# Altium schematic sheet EXTENTION_DRIVER_PCB.SchDoc
size B; SheetNumber: 1; SheetTotal: 1
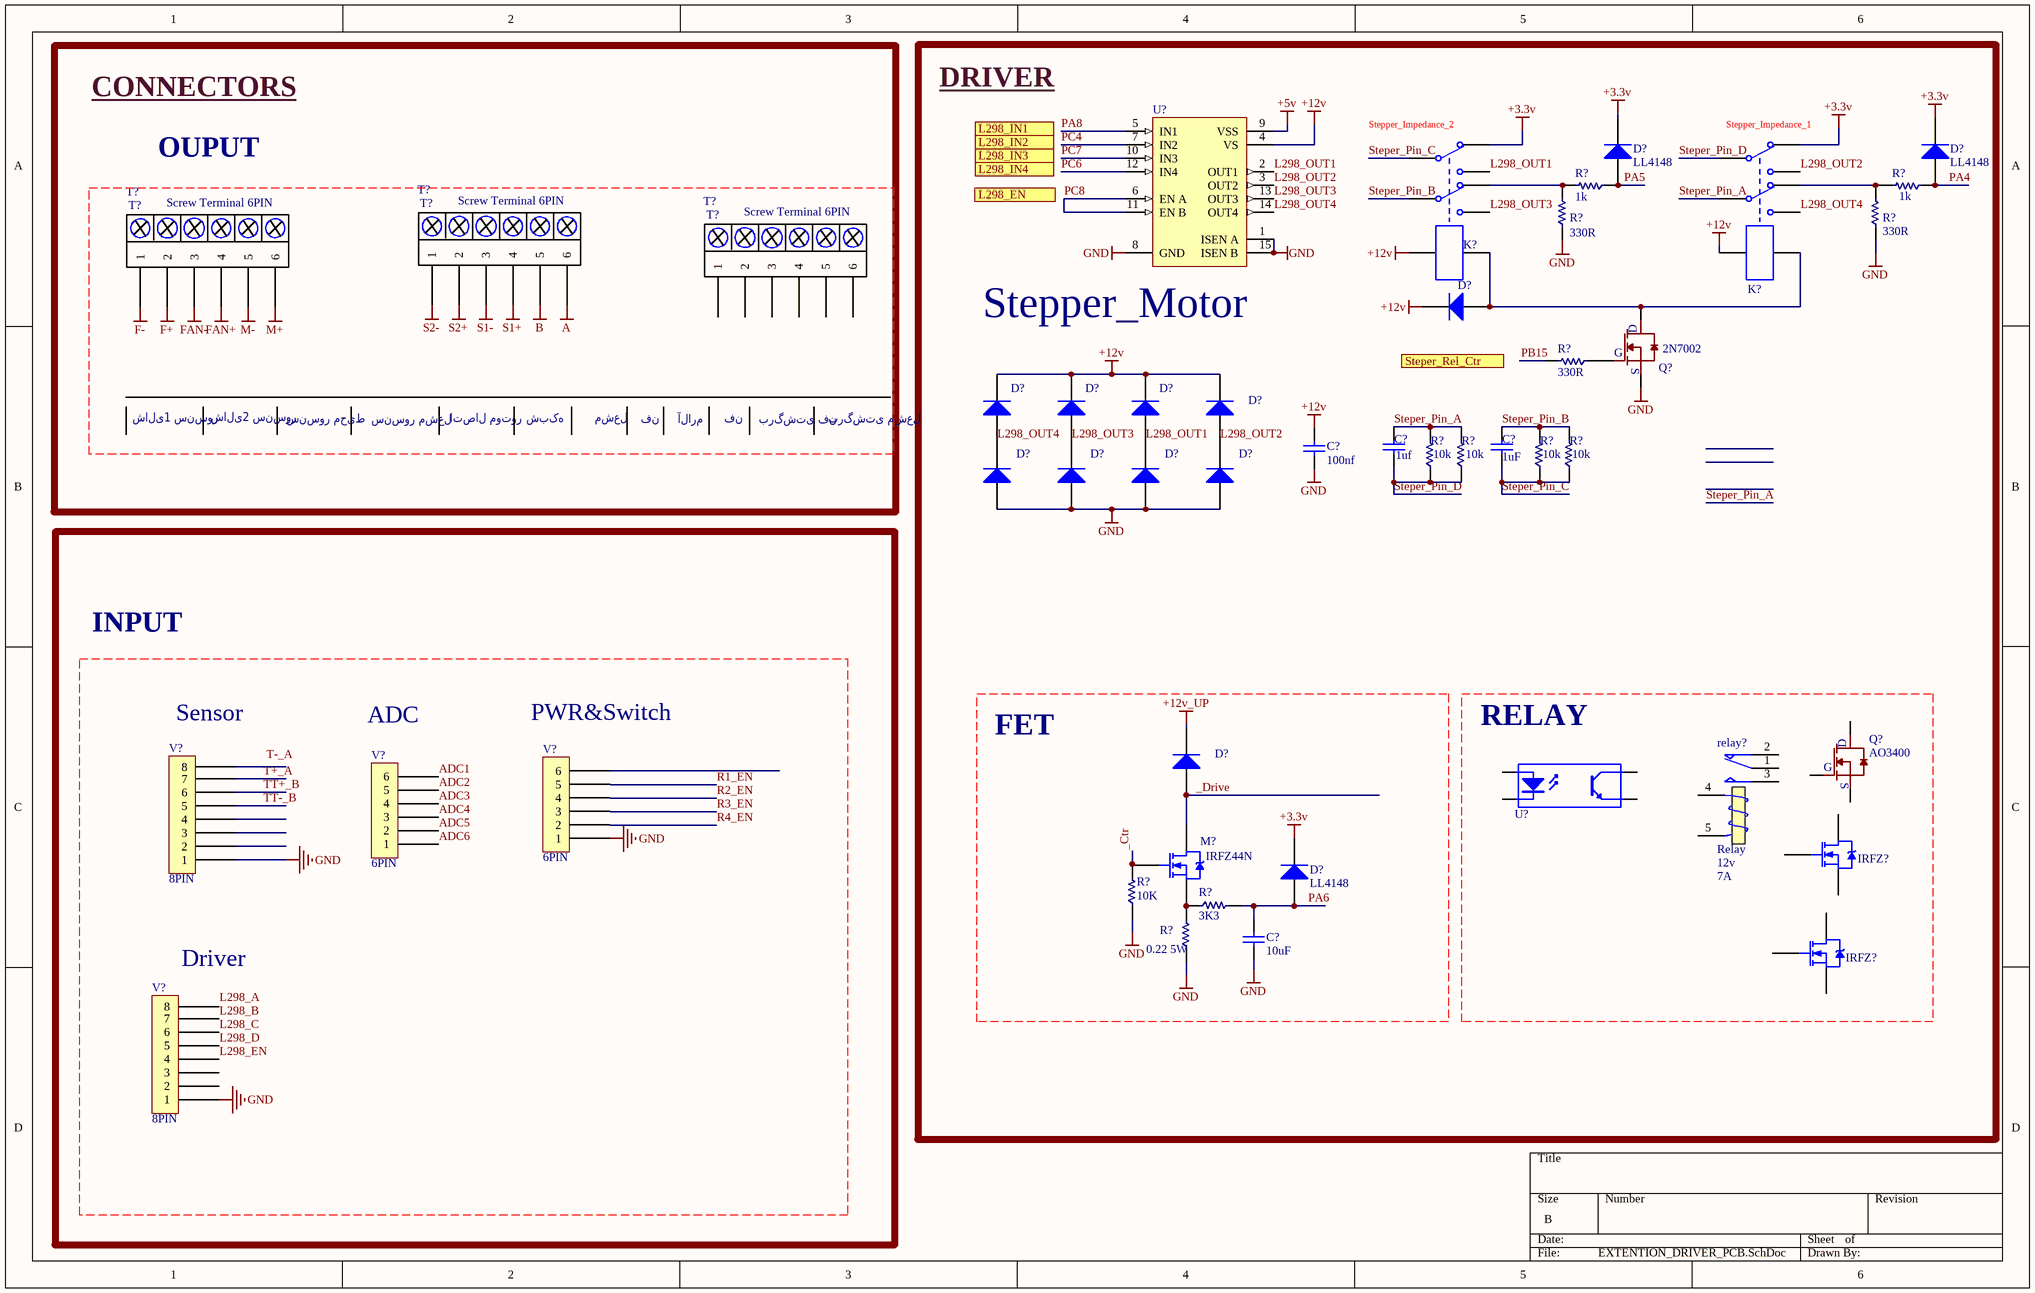
[diagram p0: EXTENTION_DRIVER_PCB.SchDoc]

## Parts
(Parts that share a designator on the sheet are numbered #1, #2 ... from top to bottom, then left to right.)
C?#1  1uF  [CAP1206]
C?#2  1uF  [CAP1206]
C?#3  100nF  [CAP1206]
C?#4  10uF  [CAP1206]
D?#1  LL4148  [mini_melf]
D?#2  LL4148  [mini_melf]
D?#3  Diode  [DO214]  (value not drawn)
D?#4  (no value)  [DO214]
D?#5  (no value)  [DO214]
D?#6  (no value)  [DO214]
D?#7  (no value)  [DO214]
D?#8  (no value)  [DO214]
D?#9  (no value)  [DO214]
D?#10  (no value)  [DO214]
D?#11  (no value)  [DO214]
D?#12  Diode  [DO214]  (value not drawn)
D?#13  LL4148  [mini_melf]
IRFZ?#1  IRFZ44N  [TO-220AB]  (value not drawn)
IRFZ?#2  IRFZ44N  [TO-252]  (value not drawn)
K?#1  Relay-Double 12V 1A  [Relay-DPDT]  (value not drawn)
K?#2  Relay-Double 12V 1A  [Relay-DPDT]  (value not drawn)
M?  IRFZ44N  [TO-220AB]
Q?#1  2N7002  [SOT23_BEC_M]
Q?#2  AO3400  [SOT23_BEC_M]
R?#1  1k  [RES1206]
R?#2  1k  [RES1206]
R?#3  330R  [RES1206]
R?#4  330R  [RES1206]
R?#5  330R  [RES1206]
R?#6  10k  [RES1206]
R?#7  10k  [RES1206]
R?#8  10k  [RES1206]
R?#9  10k  [RES1206]
R?#10  10K  [RES1206]
R?#11  3K3  [RES1206]
R?#12  value 0.22 5W  [Cement resistor]  (hidden comment: 0.22R)
relay?  Relay  voltage: 12v  current: 7A  [Relay 15.40x12.10x13.10]
T?#1  Screw Terminal 6PIN  [Screw Terminal 6PIN]
T?#2  Screw Terminal 6PIN  [Screw Terminal 6PIN]
T?#3  Screw Terminal 6PIN  [Screw Terminal 6PIN]
U?#1  L298N  [Multiwatt15V]  (value not drawn)
U?#2  EL817  [DIP4]  (value not drawn)
V?#1  6PIN  [6PIN -Right]
V?#2  6PIN  [6PIN -Right]
V?#3  8PIN  [8PIN -Right]
V?#4  8PIN  [8PIN -Right]

## Blocks framed on the sheet
Stepper_Motor: C?#1-C?#4 D?#1-D?#13 IRFZ?#1 IRFZ?#2 K?#1 K?#2 M? Q?#1 Q?#2 R?#1-R?#12 relay? U?#1 U?#2
INPUT: V?#1-V?#4

## Ports
L298_EN (in), L298_IN1 (in), L298_IN2 (in), L298_IN3 (in), L298_IN4 (in), Steper_Rel_Ctr (in)

## Nets
+3.3v: D?#1.2(K) D?#2.2(K) D?#13.2(K) K?#1.O2 K?#2.O2
+5v: U?#1.9(VSS)
+12v: C?#3.2 D?#3.2(K) D?#4.2(K) D?#5.2(K) D?#6.2(K) D?#7.2(K) K?#1.1 K?#2.1 U?#1.4(VS)
+12v_UP: D?#12.2(K)
A: T?#2.6
B: T?#2.5
F+: T?#1.2
F-: T?#1.1
FAN+: T?#1.4
FAN-: T?#1.3
GND: C?#3.1 C?#4.2 D?#8.1(A) D?#9.1(A) D?#10.1(A) D?#11.1(A) Q?#1.2(S) R?#3.1 R?#4.1 R?#10.1 R?#12.1 U?#1.1(ISEN_A) U?#1.8(GND) U?#1.15(ISEN_B) V?#1.1 V?#3.1 V?#4.1
M+: T?#1.6
M-: T?#1.5
S1+: T?#2.4
S1-: T?#2.3
S2+: T?#2.2
S2-: T?#2.1
_Ctr: M?.1(G) R?#10.2
_Drive: D?#12.1(A) M?.2(D)
ADC1: V?#2.6
ADC2: V?#2.5
ADC3: V?#2.4
ADC4: V?#2.3
ADC5: V?#2.2
ADC6: V?#2.1
L298_B: V?#4.7
L298_C: V?#4.6
L298_D: V?#4.5
L298_EN: V?#4.4
L298_OUT1: D?#6.1(A) D?#10.2(K) K?#1.S2 U?#1.2(OUT1)
L298_OUT2: D?#7.1(A) D?#11.2(K) K?#2.S2 U?#1.3(OUT2)
L298_OUT3: D?#5.1(A) D?#9.2(K) K?#1.S1 U?#1.13(OUT3)
L298_OUT4: D?#4.1(A) D?#8.2(K) K?#2.S1 U?#1.14(OUT4)
PA4: D?#2.1(A) R?#2.1
PA5: D?#1.1(A) R?#1.1
PA6: C?#4.1 D?#13.1(A) R?#11.2
PA8: U?#1.5(IN1)
PB15: R?#5.2
PC4: U?#1.7(IN2)
PC6: U?#1.12(IN4)
PC7: U?#1.10(IN3)
PC8: U?#1.6(EN_A) U?#1.11(EN_B)
R1_EN: V?#1.5
R2_EN: V?#1.4
R3_EN: V?#1.3
R4_EN: V?#1.2
Steper_Pin_A: C?#1.1 K?#2.P1 R?#6.2 R?#7.2
Steper_Pin_B: C?#2.1 K?#1.P1 R?#8.2 R?#9.2
Steper_Pin_C: C?#2.2 K?#1.P2 R?#8.1 R?#9.1
Steper_Pin_D: C?#1.2 K?#2.P2 R?#6.1 R?#7.1
T+_A: V?#3.7
TT+_B: V?#3.6
TT-_B: V?#3.5
NetD?#3_1: D?#3.1(A) K?#1.2 K?#2.2 Q?#1.3(D)
NetK?#1_O1: K?#1.O1 R?#1.2 R?#3.2
NetK?#2_O1: K?#2.O1 R?#2.2 R?#4.2
NetM?_3: M?.3(S) R?#11.1 R?#12.2
NetQ?#1_1: Q?#1.1(G) R?#5.1

Not connected (* = marked no-connect by the designer): IRFZ?#1 1(G) 2(D) 3(S); IRFZ?#2 1(G) 2(D) 3(S); Q?#2 1(G) 2(S) 3(D); relay? 1(COM) 2(NC) 3(NO) 4(T1) 5(T2); T?#3 1 2 3 4 5 6; U?#2 1(A) 2(K) 3(E) 4(C); V?#1 6; V?#3 2 3 4 8; V?#4 2 3 8

## Notes on the sheet
- CONNECTORS
- DRIVER
- OUPUT
- (near K?#1) Stepper_Impedance_2
- (near K?#2) Stepper_Impedance_1
- شالی1 سنسور
- شالی2 سنسور
- سنسور محیط
- سنسور مشعل
- اتصال موتور
- شبکه
- مشعل
- فن
- آلارم
- برگشتی فن
- برگشتی مشعل
- (near V?#3) Sensor
- (near V?#2) ADC
- (near V?#1) PWR&Switch
- FET
- (near U?#2) RELAY
- (near V?#4) Driver
- Labels drawn without touching a wire or pin: L298_A, T-_A

## Library data of the parts
C?#1 C?#2 = Cap-smd-1206-1uf: cap_no_polar_seramic_multilayer; manufacture: Chaozhou Three-circle (Group) Co; manufacture p-n: TCC1206X7R103K500DT; LIBRARY PATCH: R_C_D_T.SchLib; Rahkaran: ‎1010600292; value: 1uf; part: Cap-smd-1206-1uf; case: 1206; supplier1: javan; supplier1 p-n: 10UF (1206) 50V 10% X7R; Footprint Patch: R_C_D_T.PcbLib
C?#3 = Cap-smd-1206-100nf: cap_no_polar_seramic_multilayer; manufacture: Chaozhou Three-circle (Group) Co; manufacture p-n: TCC1206X7R104K500DT; LIBRARY PATCH: R_C_D_T.SchLib; Rahkaran: 1010600301; value: 100nf; part: Cap-smd-1206-100nf; case: 1206; supplier1: javan; supplier1 p-n: 100NF (1206) 50V 10% X7R; Footprint Patch: R_C_D_T.PcbLib
C?#4 = Cap-smd-1206-10uf: cap_no_polar_seramic_multilayer; manufacture: Samwha Capacitor; manufacture p-n: CS3216X5R106K250NRI; LIBRARY PATCH: R_C_D_T.SchLib; Rahkaran: 1010600295; value: 10uf; part: Cap-smd-1206-10uf; case: 1206; supplier1: javan; supplier1 p-n: 10UF (1206) 25V X5R; Footprint Patch: R_C_D_T.PcbLib
D?#1 D?#2 D?#13 = Diode-LL4148-smd: 3 Amp Medium Power Silicon Rectifier Diode; manufacture: Semtech Electronics; designer: RASHID_BEHDARVAND; value: 75V,200mA; LIBRARY PATCH: R_C_D_T.SchLib; Rahkaran: ‎1010700352; PackageDescription: Diode, Axial; Body 9.5 x 5.3 mm (LxDia. max), Lead Dia. 1.32 mm (max); part: Diode-LL4148-smd; manufacture p-n: LL4148; supplier1: javan; supplier1 p-n: LL4148; Footprint Patch: R_C_D_T.PcbLib; PackageReference: DO-201AD
D?#3-D?#12 = Diode-fast-uf4007-smd: 3 Amp Medium Power Silicon Rectifier Diode; manufacture: FlyNoval; manufacture p-n: aFnIC_10263; designer: RASHID_BEHDARVAND; LIBRARY PATCH: R_C_D_T.SchLib; Rahkaran: 1010700360; PackageReference: DO-201AD; PackageDescription: Diode, Axial; Body 9.5 x 5.3 mm (LxDia. max), Lead Dia. 1.32 mm (max); part: Diode-fast-uf4007-smd; supplier1: amazon; supplier1 p-n: SMD US1M UF4007 1A; Footprint Patch: R_C_D_T.PcbLib
IRFZ?#1 M? = Mosfet-n-channel-IRFZ44N: N-Channel Power MOSFET; manufacture: China; manufacture p-n: IRFZ44NPBF; Note: Pin 2 is electrically connected to pin 4.; value: 55 V; LIBRARY PATCH: R_C_D_T.SchLib; Rahkaran: ‎1010300256; Published: 8-Jun-2000; LatestRevisionDate: 17-Jul-2002; LatestRevisionNote: Re-released for DXP Platform.; DatasheetVersion: PD-9.814; PackageVersion: Feb-1997; PackageReference: TO-220AB; Publisher: Altium Limited; PackageDescription: TO, Thru-Hole, Vertical, Heatsink Mounted; 3 In-Line Leads; Pitch 2.54 mm; ComponentLink1Description: Manufacturer Link; ComponentLink1URL: http://www.irf.com/; part: Mosfet-n-channel-IRFZ44N; supplier1: javan; supplier1 p-n: N-MOS; Footprint Patch: R_C_D_T.PcbLib
IRFZ?#2 = IRLR8743: N-Channel Power MOSFET; manufacture: Type of Control Channel: N -Channel; manufacture p-n: 160A,2.35v; Note: Pin 2 is electrically connected to pin 4.; LIBRARY PATCH: R_C_D_T.SchLib; Rahkaran: ‎1010300258; Published: 8-Jun-2000; LatestRevisionDate: 17-Jul-2002; LatestRevisionNote: Re-released for DXP Platform.; DatasheetVersion: PD-9.814; PackageVersion: Feb-1997; PackageReference: TO-220AB; Publisher: Altium Limited; PackageDescription: TO, Thru-Hole, Vertical, Heatsink Mounted; 3 In-Line Leads; Pitch 2.54 mm; ComponentLink1Description: Manufacturer Link; ComponentLink1URL: http://www.irf.com/; part: IRLR8743; supplier1: javan; Footprint Patch: R_C_D_T.PcbLib
K?#1 K?#2 = Relay-Double: Dual-Pole Dual-Throw Relay; manufacture: Ningbo Tianbo Ganglian Electronics; manufacture p-n: HJR1-2CL-12V; value: 12V 1A; LIBRARY PATCH: NKH_Contacts.SchLib; Rahkaran: ‎1010800375; Published: 24-Mar-1999; LatestRevisionDate: 17-Jul-2002; LatestRevisionNote: Re-released for DXP Platform.; PackageReference: DIP-P8; Publisher: Altium Limited; part: Relay-Double; case: SPdT dip; supplier1: javan; supplier1 p-n: RELAY 12V 1A 2C 8PIN; Footprint Patch: NKH_Contacts.PcbLib
Q?#1 = Mosfet-n-channel-2n7002: manufacture: Toshiba Corporation; manufacture p-n: T2N7002AK,LM; LIBRARY PATCH: R_C_D_T.SchLib; Rahkaran: ‎1010301739; part: Mosfet-n-channel-2n7002; supplier1: javan; supplier1 p-n: 2N7002A; Footprint Patch: R_C_D_T.PcbLib
Q?#2 = AO3400A: manufacture: Alpha & Omega Semiconductor; LIBRARY PATCH: R_C_D_T.SchLib; Rahkaran: ‎1010300831; part: AO3400A; manufacture p-n: AO3400A; supplier1: javan; supplier1 p-n: AO3400A; Footprint Patch: R_C_D_T.PcbLib; datasheet link: datasheet
R?#1 R?#2 = resistor-smd-1206-1k: manufacture: ANHUI VICO TECHNOLOGIES CO.; manufacture p-n: 1K (1206) 1%; designer: rashid_behdarvand; LIBRARY PATCH: R_C_D_T.SchLib; Rahkaran: 1012000595; part: resistor-smd-1206-1k; value: 1k; case: 1206; supplier1: javan; supplier1 p-n: 1K (1206) 1%; Footprint Patch: R_C_D_T.PcbLib
R?#3-R?#5 = resistor-smd-1206-330-ohm: manufacture: ANHUI VICO TECHNOLOGIES CO.; manufacture p-n: SCR1206J0331AV; designer: rashid_behdarvand; LIBRARY PATCH: R_C_D_T.SchLib; Rahkaran: ‎1012000632; part: resistor-smd-1206-330-ohm; value: 330-ohm; case: 1206; supplier1: javan; supplier1 p-n: 330 (1206); Footprint Patch: R_C_D_T.PcbLib
R?#6-R?#10 = resistor-smd-1206-10k: manufacture: ANHUI VICO TECHNOLOGIES CO.; manufacture p-n: 10K (1206) 1%; designer: rashid_behdarvand; LIBRARY PATCH: R_C_D_T.SchLib; Rahkaran: 1012000582; part: resistor-smd-1206-10k; value: 10k; case: 1206; supplier1: javan; supplier1 p-n: 10K (1206) 1%; Footprint Patch: R_C_D_T.PcbLib
R?#11 = resistor-smd-1206-3.3k: manufacture: ANHUI VICO TECHNOLOGIES CO.; manufacture p-n: 3.3K (1206) 1%; designer: rashid_behdarvand; value: 3.3k; LIBRARY PATCH: R_C_D_T.SchLib; Rahkaran: 1012000627; part: resistor-smd-1206-3.3k; case: 1206; supplier1: javan; supplier1 p-n: 3.3K (1206) 1%; Footprint Patch: R_C_D_T.PcbLib
R?#12 = resistor-cement-0.22R-5w: manufacture: Zenithsun Electronics Tech; manufacture p-n: SQP5W-0.22OHM-J; designer: rashid_behdarvand; LIBRARY PATCH: R_C_D_T.SchLib; Rahkaran: ‎1012000664; part: resistor-cement-0.22R-5w; supplier1: javan; supplier1 p-n: 0.22 5W; Footprint Patch: R_C_D_T.PcbLib
relay? = Relay: Relay  Baby Milon-12V, 10A; designer: rashid_behdarvand; LIBRARY PATCH: NKH_Contacts.SchLib; Rahkaran: 1010800711; part: Relay; supplier1: eshop; supplier1 p-n: 12V,10A,KHE; Footprint Patch: NKH_Contacts.PcbLib
T?#1-T?#3 = Screw Terminal 6PIN: LIBRARY PATCH: NKH_Contacts.SchLib; part: Screw Terminal 6PIN; value: 6PIN; supplier1: javan; Footprint Patch: NKH_Contacts.PcbLib
U?#1 = L298N: Dual Full Bridge Driver; manufacture: STMicroelectronics; Revision 1: 24-Aug-2001: Footprint Added.; Revision 2: 17-Jul-2002: Re-released for DXP Platform.; Package Information: Latest Revision: Apr-1998; value: 2 A; LIBRARY PATCH: NKH_IC.SchLib; Rahkaran: ‎1012300089; Published: 8-Jun-2000; Datasheet: Latest Revision: Jul-1999; Package Reference: Multiwatt15H; Publisher: Altium Limited; part: L298N; case: Multiwatt-15; manufacture p-n: L298N; supplier1: javan; supplier1 p-n: L298N; Footprint Patch: NKH_IC.PcbLib
U?#2 = PC817: 4-Pin Phototransistor Optocoupler; part: PC817; manufacture: SHARP Corporation; manufacture p-n: PC817X3NSZ2B; value: , 5000 VRMS , 4PIN; LIBRARY PATCH: R_C_D_T.SchLib; Rahkaran: ‎1012300777; Published: 24-Mar-1999; LatestRevisionDate: 04-Mar-2005; LatestRevisionNote: Sch pins 3 & 4 Swapped.; DatasheetVersion: Nov-2003; PackageReference: DIP-4; Publisher: Altium Limited; supplier1: javan; supplier1 p-n: PC817; Footprint Patch: R_C_D_T.PcbLib
V?#1 V?#2 = VH_ST_6pin_Right: connector power 6pin stright lock; LIBRARY PATCH: NKH_Contacts.SchLib; part: VH_ST_6pin_Right; value: Connector; Footprint Patch: NKH_Contacts.PcbLib
V?#3 V?#4 = VH_ST_8pin_Right: connector power 8pin stright lock; LIBRARY PATCH: NKH_Contacts.SchLib; part: VH_ST_8pin_Right; value: Connector; Footprint Patch: NKH_Contacts.PcbLib